# Altium schematic sheet LVDS_ADC.SchDoc: ADC &
size 420 x 297 mm; CheckedBy: MK; Author: G.K.; CompanyName: CREOTECH; DrawnBy: G.K.; Organization: CTI SA; Address1: Creotech Instruments SA; Address2: Okulickiego 7/9, 05-500 Poland; DocumentNumber: 2; Revision: -; SheetNumber: 2; SheetTotal: 5; ModifiedBy: -; CreateDate: XX/XX/XXXX; CheckedDate: -; Title2: reference; DivGrp: CTI; Designer: G.K.; ModifiedDate: -; ProjectName: FMC DAC 100M 14B 16CHA ADC 2M 14B 4CHA
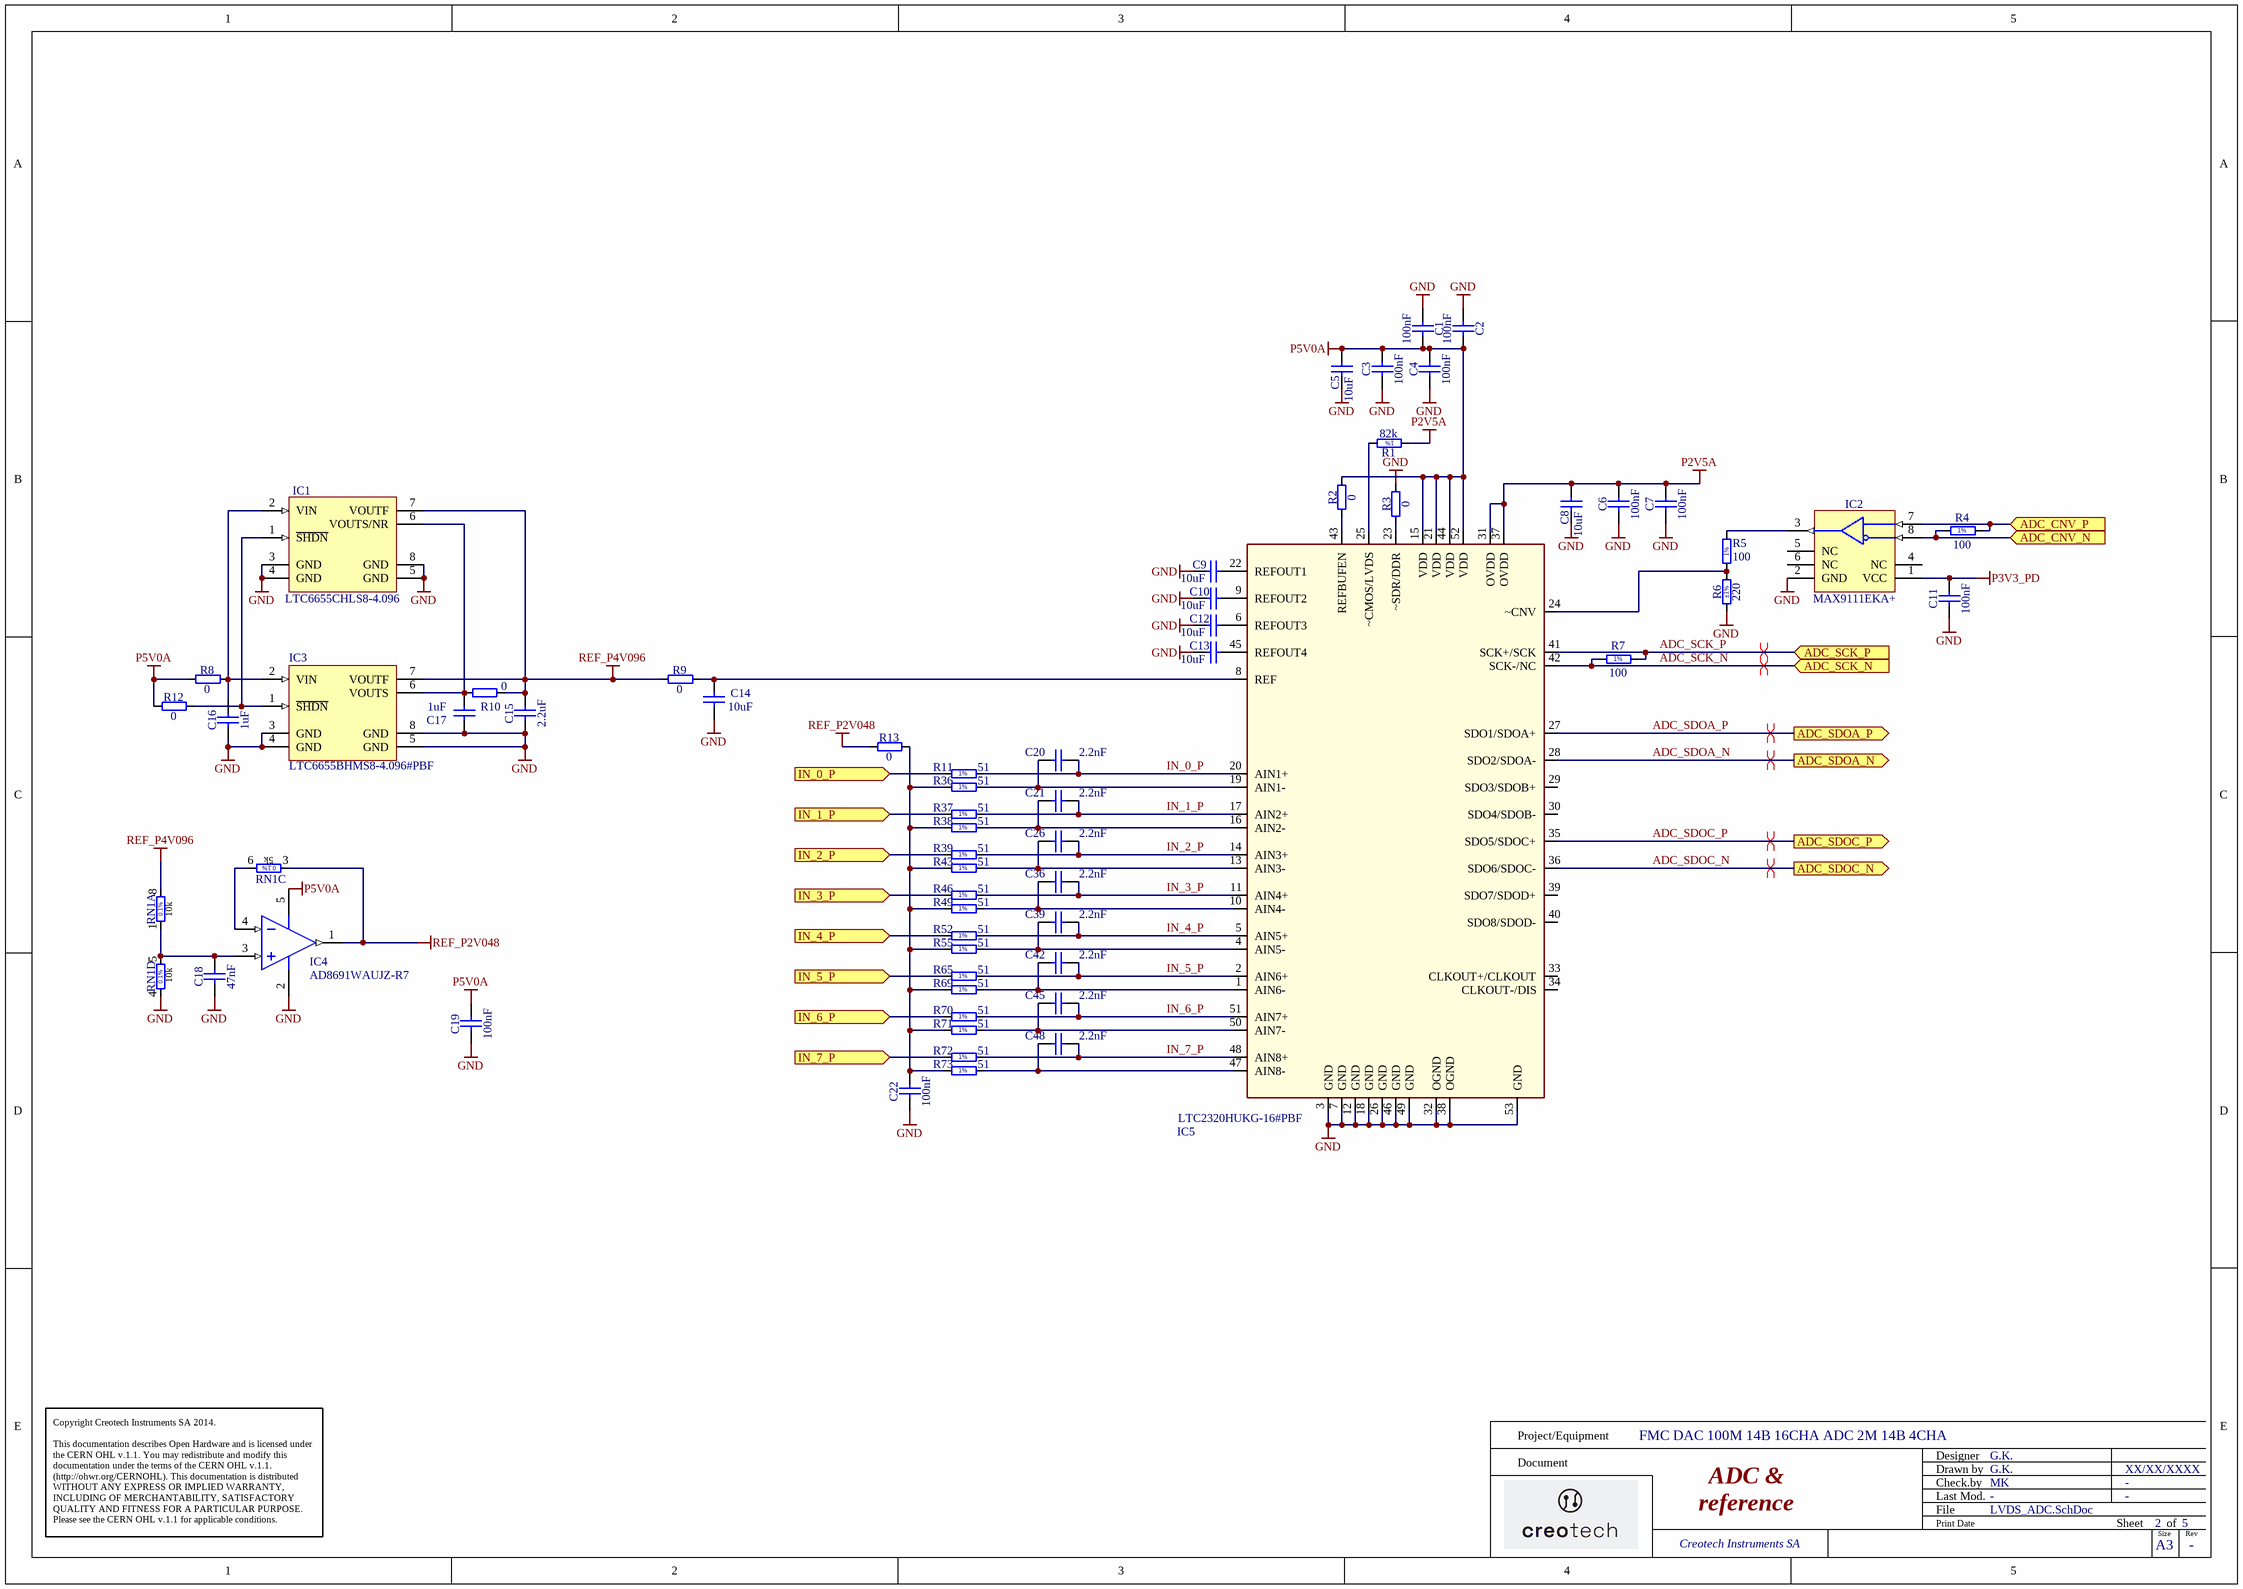
[diagram p0: LVDS_ADC.SchDoc]

## Parts
C1  100nF  [CAPC1608X87N]
C2  100nF  [CAPC1608X87N]
C3  100nF  [CAPC1608X87N]
C4  100nF  [CAPC1608X87N]
C5  10uF  [CAPC2012X95N]
C6  100nF  [CAPC1608X87N]
C7  100nF  [CAPC1608X87N]
C8  10uF  [CAPC2012X95N]
C9  10uF  [CAPC2012X95N]
C10  10uF  [CAPC2012X95N]
C11  100nF  [CAPC1608X87N]
C12  10uF  [CAPC2012X95N]
C13  10uF  [CAPC2012X95N]
C14  10uF  [CAPC2012X95N]
C15  2.2uF  [CAPC1608X87N]
C16  1uF  [CAPC1608X87N]
C17  1uF  [CAPC1608X87N]
C18  47nF  [CAPC2012X135N]
C19  100nF  [CAPC1005X55N]
C20  2.2nF  [CAPC2013X100N]
C21  2.2nF  [CAPC2013X100N]
C22  100nF  [CAPC1005X55N]
C26  2.2nF  [CAPC2013X100N]
C36  2.2nF  [CAPC2013X100N]
C39  2.2nF  [CAPC2013X100N]
C42  2.2nF  [CAPC2013X100N]
C45  2.2nF  [CAPC2013X100N]
C48  2.2nF  [CAPC2013X100N]
IC1  LTC6655CHLS8-4.096  [LCCS127P500X500X145-8N]
IC2  MAX9111EKA+  [SOT65P280X145-8N]
IC3  LTC6655BHMS8-4.096#PBF  [SOP65P490X110-8N]
IC4  AD8691WAUJZ-R7  [ADI-UJ-5_L]
IC5  LTC2320HUKG-16#PBF  [QFN50P700X800X80_HS-53M]
R1  82k  [RESC1608X55N]
R2  0  [RESC1005X40N]
R3  0  [RESC1005X40N]
R4  100  [RESC1005X40N]
R5  100  [RESC1005X40N]
R6  220  Tolerance: ±1%  [RESC1005X40N]
R7  100  [RESC1005X40N]
R8  0  [RESC1005X40N]
R9  0  [RESC1005X40N]
R10  0  [RESC1005X40N]
R11  51  [RESC1005X40N]
R12  0  [RESC1005X40N]
R13  0  [RESC1005X40N]
R36  51  [RESC1005X40N]
R37  51  [RESC1005X40N]
R38  51  [RESC1005X40N]
R39  51  [RESC1005X40N]
R43  51  [RESC1005X40N]
R46  51  [RESC1005X40N]
R49  51  [RESC1005X40N]
R52  51  [RESC1005X40N]
R55  51  [RESC1005X40N]
R65  51  [RESC1005X40N]
R69  51  [RESC1005X40N]
R70  51  [RESC1005X40N]
R71  51  [RESC1005X40N]
R72  51  [RESC1005X40N]
R73  51  [RESC1005X40N]
RN1  10k 5K 5K 10K  [SOIC127P600X175-8N]  (value not drawn)  (parts A,C,D of 4)

## Ports
ADC_CNV_N (in), ADC_CNV_P (in), ADC_SCK_N (in), ADC_SCK_P (in), ADC_SDOA_N (out), ADC_SDOA_P (out), ADC_SDOC_N (out), ADC_SDOC_P (out), IN_0_P (in), IN_1_P (in), IN_2_P (in), IN_3_P (in), IN_4_P (in), IN_5_P (in), IN_6_P (in), IN_7_P (in)

## Nets
GND: C1.1 C2.1 C3.1 C4.1 C5.1 C6.1 C7.1 C8.1 C9.1 C10.1 C11.1 C12.1 C13.1 C14.1 C15.1 C16.1 C17.1 C18.1 C19.1 C22.1 IC1.3(GND) IC1.4(GND) IC1.5(GND) IC1.8(GND) IC2.2(GND) IC3.3(GND) IC3.4(GND) IC3.5(GND) IC3.8(GND) IC4.2(-V) IC5.3(GND) IC5.7(GND) IC5.12(GND) IC5.18(GND) IC5.26(GND) IC5.32(OGND) IC5.38(OGND) IC5.46(GND) IC5.49(GND) IC5.53(GND) R3.2 R6.1 RN1.4
P2V5A: C6.2 C7.2 C8.2 IC5.31(OVDD) IC5.37(OVDD) R1.1
P3V3_PD: C11.2 IC2.1(VCC)
P5V0A: C1.2 C2.2 C3.2 C4.2 C5.2 C19.2 IC4.5(+V) IC5.15(VDD) IC5.21(VDD) IC5.44(VDD) IC5.52(VDD) R2.2 R8.1 R12.1
REF_P2V048: IC4.1(OUT) R13.1 RN1.3
REF_P4V096: C15.2 IC1.7(VOUTF) IC3.7(VOUTF) R9.1 R10.2 RN1.8
ADC_CNV_N: IC2.8(IN-) R4.1 ; port ADC_CNV_N
ADC_CNV_P: IC2.7(IN+) R4.2 ; port ADC_CNV_P
ADC_SCK_N: IC5.42(SCK-/NC) R7.1 ; port ADC_SCK_N
ADC_SCK_P: IC5.41(SCK+/SCK) R7.2 ; port ADC_SCK_P
ADC_SDOA_N: IC5.28(SDO2/SDOA-) ; port ADC_SDOA_N
ADC_SDOA_P: IC5.27(SDO1/SDOA+) ; port ADC_SDOA_P
ADC_SDOC_N: IC5.36(SDO6/SDOC-) ; port ADC_SDOC_N
ADC_SDOC_P: IC5.35(SDO5/SDOC+) ; port ADC_SDOC_P
IN_0_P: C20.1 IC5.20(AIN1+) R11.2
IN_0_P: R11.1 ; port IN_0_P  [a separate net that carries the same name]
IN_1_P: C21.1 IC5.17(AIN2+) R37.2
IN_1_P: R37.1 ; port IN_1_P  [a separate net that carries the same name]
IN_2_P: C26.1 IC5.14(AIN3+) R39.2
IN_2_P: R39.1 ; port IN_2_P  [a separate net that carries the same name]
IN_3_P: C36.1 IC5.11(AIN4+) R46.2
IN_3_P: R46.1 ; port IN_3_P  [a separate net that carries the same name]
IN_4_P: C39.1 IC5.5(AIN5+) R52.2
IN_4_P: R52.1 ; port IN_4_P  [a separate net that carries the same name]
IN_5_P: C42.1 IC5.2(AIN6+) R65.2
IN_5_P: R65.1 ; port IN_5_P  [a separate net that carries the same name]
IN_6_P: C45.1 IC5.51(AIN7+) R70.2
IN_6_P: R70.1 ; port IN_6_P  [a separate net that carries the same name]
IN_7_P: C48.1 IC5.48(AIN8+) R72.2
IN_7_P: R72.1 ; port IN_7_P  [a separate net that carries the same name]
NetC9_2: C9.2 IC5.22(REFOUT1)
NetC10_2: C10.2 IC5.9(REFOUT2)
NetC12_2: C12.2 IC5.6(REFOUT3)
NetC13_2: C13.2 IC5.45(REFOUT4)
NetC14_2: C14.2 IC5.8(REF) R9.2
NetC16_2: C16.2 IC1.2(VIN) IC3.2(VIN) R8.2
NetC17_2: C17.2 IC1.6(VOUTS/NR) IC3.6(VOUTS) R10.1
NetC18_2: C18.2 IC4.3(+IN) RN1.1 RN1.5
NetC20_2: C20.2 IC5.19(AIN1-) R36.2
NetC21_2: C21.2 IC5.16(AIN2-) R38.2
NetC22_2: C22.2 R13.2 R36.1 R38.1 R43.1 R49.1 R55.1 R69.1 R71.1 R73.1
NetC26_2: C26.2 IC5.13(AIN3-) R43.2
NetC36_2: C36.2 IC5.10(AIN4-) R49.2
NetC39_2: C39.2 IC5.4(AIN5-) R55.2
NetC42_2: C42.2 IC5.1(AIN6-) R69.2
NetC45_2: C45.2 IC5.50(AIN7-) R71.2
NetC48_2: C48.2 IC5.47(AIN8-) R73.2
NetIC1_1: IC1.1(~{SHDN}) IC3.1(~{SHDN}) R12.2
NetIC2_3: IC2.3(OUT) R5.2
NetIC4_4: IC4.4(-IN) RN1.6
NetIC5_23: IC5.23(~SDR/DDR) R3.1
NetIC5_24: IC5.24(~CNV) R5.1 R6.2
NetIC5_25: IC5.25(~CMOS/LVDS) R1.2
NetIC5_43: IC5.43(REFBUFEN) R2.1

Not connected (* = marked no-connect by the designer): IC2 4(NC) 5(NC) 6(NC); IC5 29(SDO3/SDOB+) 30(SDO4/SDOB-) 33(CLKOUT+/CLKOUT) 34(CLKOUT-/DIS) 39(SDO7/SDOD+) 40(SDO8/SDOD-)

## Layout directives
differential pair: ADC_SCK_N, ADC_SCK_P, ADC_SDOA_N, ADC_SDOA_P, ADC_SDOC_N, ADC_SDOC_P

## Notes on the sheet
- Project/Equipment
- Document
- Designer
- Drawn by
- Check.by
- Copyright Creotech Instruments SA 2014.
  This documentation describes Open Hardware and is licensed under the CERN OHL v.1.1. You may redistribute and modify this documentation under the terms of the CERN OHL v.1.1. (http://ohwr.org/CERNOHL). This documentation is distributed WITHOUT ANY EXPRESS OR IMPLIED WARRANTY, INCLUDING OF MERCHANTABILITY, SATISFACTORY QUALITY AND FITNESS FOR A PARTICULAR PURPOSE. Please see the CERN OHL v.1.1 for applicable conditions.
- File
- Last Mod.
- Print Date
- Sheet
- Size
- A3
- of
- Rev
- (in symbol R0402_51R_1%_0.0625W_100PPM) 1%
- (in symbol R0402_100R_1%_0.1W_100PPM) 1%
- (in symbol R0603_82K_1%_0.1W_100PPM) 1%
- (in symbol RN_10K_5K_VISHAY_AORN2-1AT3, part A) 10k
- (in symbol RN_10K_5K_VISHAY_AORN2-1AT3, part C) 5k
- (in symbol RN_10K_5K_VISHAY_AORN2-1AT3, part D) 10k

## Library data of the parts
C1-C4 C6 C7 C11 = CC0603_100NF_50V_10%_X7R: Non-polarised capacitor; Part Description: SMD Multilayer Chip Ceramic Capacitor; Manufacturer: GENERIC; Manufacturer1 Part Number: 223858615649; Voltage: 50V; TC: X7R; Tolerance: ±10%; Part Number: CC0603_100NF_50V_10%_X7R; Component Kind: Standard; Component Type: Standard; Pin Count: 2; Value: 100nF; Status: Preferred; Manufacturer Part Number: CC0603_100NF_50V_10%_X7R; Case: 0603; Mounted: Yes; Socket: No; SMD: Yes; Sense: No; Manufacturer1 Example: PHYCOMP; Manufacturer1 ComponentHeight: 0.87mm; HelpURL: \\cern.ch\dfs\Applications\Altium\Datasheets\CC0603_X7R_PHYCOMP.pdf; Author: CERN DEM JLC; CreateDate: 03.12.2007; LatestRevisionDate: 03.12.2007
C5 C8-C10 C12-C14 = CC0805_10UF_25V_10%_X5R: Non-polarised capacitor; Part Description: SMD Multilayer Chip Ceramic Capacitor; Manufacturer: GENERIC; Manufacturer1 Part Number: GRM219R61E106KA12D; Voltage: 25V; TC: X5R; Tolerance: ±10%; Part Number: CC0805_10UF_25V_10%_X5R; Component Kind: Standard; Component Type: Standard; Pin Count: 2; Value: 10uF; Status: Preferred; Manufacturer Part Number: CC0805_10UF_25V_10%_X5R; Case: 0805; Mounted: Yes; Socket: No; SMD: Yes; Sense: No; Manufacturer1 Example: MURATA; Manufacturer1 ComponentHeight: 0.95mm; HelpURL: \\cern.ch\dfs\Applications\Altium\Datasheets\CC0805_X5R_MURATA_GRM.pdf; Author: CERN DEM JLC; CreateDate: 25.10.2012; LatestRevisionDate: 06.09.2016
C15 = CC0603_2.2UF_16V_10%_X5R: Non-polarised capacitor; Part Description: SMD Multilayer Chip Ceramic Capacitor; Manufacturer: GENERIC; Manufacturer1 Part Number: CC0603KRX5R7BB225; Voltage: 16V; TC: X5R; Tolerance: ±10%; Part Number: CC0603_2.2UF_16V_10%_X5R; Component Kind: Standard; Component Type: Standard; Pin Count: 2; Value: 2.2uF; Status: Preferred; Manufacturer Part Number: CC0603_2.2UF_16V_10%_X5R; Case: 0603; Mounted: Yes; Socket: No; SMD: Yes; Sense: No; Manufacturer1 Example: YAGEO; Manufacturer1 ComponentHeight: 0.9mm; HelpURL: \\cern.ch\dfs\Applications\Altium\Datasheets\CC0805_X5R_PHYCOMP_HC.pdf; Author: CERN DEM JLC; CreateDate: 28.04.2011; LatestRevisionDate: 28.04.2011
C16 C17 = CC0603_1UF_25V_10%_X7R: Non-polarised capacitor; Part Description: SMD Multilayer Chip Ceramic Capacitor; Manufacturer: GENERIC; Manufacturer1 Part Number: GRM188R71E105KA12D; Voltage: 25V; TC: X7R; Tolerance: ±10%; Part Number: CC0603_1UF_25V_10%_X7R; Component Kind: Standard; Component Type: Standard; Pin Count: 2; Value: 1uF; Status: None; Manufacturer Part Number: CC0603_1UF_25V_10%_X7R; Case: 0603; Mounted: Yes; Socket: No; SMD: Yes; Sense: No; Manufacturer1 Example: MURATA; Manufacturer1 ComponentHeight: 0.9mm; HelpURL: \\cern.ch\dfs\Applications\Altium\Datasheets\CC0603_X7R_MURATA.pdf; Author: CERN DEM JLC; CreateDate: 18.01.2011; LatestRevisionDate: 18.01.2011
C18 = CC0805_47NF_25V_5%_C0G: Non-polarised capacitor; Part Description: SMD Multilayer Chip Ceramic Capacitor; Manufacturer: GENERIC; Manufacturer1 Part Number: C0805C473J3GACTU; Voltage: 25V; TC: C0G/NP0; Tolerance: ±5%; Part Number: CC0805_47NF_25V_5%_C0G; Component Kind: Standard; Component Type: Standard; Pin Count: 2; Value: 47nF; Status: None; Manufacturer Part Number: CC0805_47NF_25V_5%_C0G; Case: 0805; Mounted: Yes; Socket: No; SMD: Yes; Sense: No; Manufacturer1 Example: KEMET; Manufacturer1 ComponentHeight: 1.4mm; HelpURL: \\cern.ch\dfs\Applications\Altium\Datasheets\CC0805_C0G_KEMET_(Commercial Grade).pdf; Author: CERN DEM JLC; CreateDate: 18.01.2011; LatestRevisionDate: 18.01.2011
C19 C22 = CC0402_100NF_16V_10%_X5R: Non-polarised capacitor; Part Description: SMD Multilayer Chip Ceramic Capacitor; Manufacturer: GENERIC; Manufacturer1 Part Number: GRM155R61C104KA88D; Voltage: 16V; TC: X5R; Tolerance: ±10%; Part Number: CC0402_100NF_16V_10%_X5R; Component Kind: Standard; Component Type: Standard; Pin Count: 2; Value: 100nF; Status: None; Manufacturer Part Number: CC0402_100NF_16V_10%_X5R; Case: 0402; Mounted: Yes; Socket: No; SMD: Yes; Sense: No; Manufacturer1 Example: MURATA; Manufacturer1 ComponentHeight: 0.55mm; HelpURL: \\cern.ch\dfs\Applications\Altium\Datasheets\CC0402_X5R_MURATA_GRM.pdf; Author: CERN DEM JLC; CreateDate: 10.12.2013; LatestRevisionDate: 10.12.2013
C20 C21 C26 C36 C39 C42 C45 C48 = CC0805_2.2NF_25V_1%_C0G: Non-polarised capacitor; Part Description: SMD Multilayer Chip Ceramic Capacitor; Manufacturer: GENERIC; Manufacturer1 Part Number: C0805C222F3GACTU; Voltage: 25V; TC: C0G/NP0; Tolerance: ±1%; Part Number: CC0805_2.2NF_25V_1%_C0G; Component Kind: Standard; Component Type: Standard; Pin Count: 2; Value: 2.2nF; Status: None; Manufacturer Part Number: CC0805_2.2NF_25V_1%_C0G; Case: 0805; Mounted: Yes; Socket: No; SMD: Yes; Sense: No; Manufacturer1 Example: KEMET; Manufacturer1 ComponentHeight: 0.88mm; HelpURL: \\cern.ch\dfs\Applications\Altium\Datasheets\CC0805_C0G_KEMET_(Commercial Grade).pdf; Author: CERN DEM JLC; CreateDate: 11.03.2015; LatestRevisionDate: 11.03.2015
IC1 = REF_LTC6655CHLS8-4.096: 4.096, 1uA Precision Voltage Reference; Part Number: LTC6655CHLS8-4.096#PBF; Part Description: 4.096V, 0.05%, 10ppm/°C, 1uA Precision Voltage Reference; Manufacturer: LINEAR TECHNOLOGY; PressFit: No; Bonding: No; Component Kind: Standard; Component Type: Standard; Device: LTC6655CHLS8-4.096; Footprint: SOT95P280X100-6N; PackageDescription: LCC, 8-Pins, Body 5,00x5,00mmx1,45mm, Pitch 1,27mm, IPC Medium Density; Manufacturer Part Number: LTC6655CHLS8-4.096#PBF; Pin Count: 8; Case: 8-CLCC; Mounted: Yes; Socket: No; SMD: Yes; Sense: No; ComponentHeight: 1mm; HelpURL: \\cern.ch\dfs\Applications\Altium\Datasheets\LT6656ACS6-3.3#TRMPBF.pdf; Author: GK; CreateDate: 2011-10-10; LatestRevisionDate: 2011-10-10
IC2 = MAX9111EKA+: Single LVDS Line Receiver with Ultra-Low Pulse Skew; Manufacturer: MAXIM; PressFit: No; Bonding: No; Part Number: MAX9111EKA+; Component Kind: Standard; Component Type: Standard; Device: MAX9111EKA+; PackageDescription: SOT, 0.65mm pitch; 8 pin, 1.625mm W X 2.90mm L X 1.45mm H body, IPC Medium Density; Part Description: Single LVDS Line Receiver with Ultra-Low Pulse Skew; Manufacturer Part Number: MAX9111EKA+; Pin Count: 8; Case: SOT23-8; Mounted: Yes; Socket: No; SMD: Yes; Sense: No; ComponentHeight: 1.45mm; Author: CERN DEM JLC; HelpURL: \\cern.ch\dfs\Applications\Altium\Datasheets\MAX9111EKA+.pdf; CreateDate: 26.09.2013; LatestRevisionDate: 26.09.2013
IC3 = REF_LTC6655: 0.25ppm Noise, Low Drift Precision Buffered Voltage Reference; Part Description: 4.096V, 0.25ppm Noise, Low Drift Precision Buffered Voltage Reference; Manufacturer: LINEAR TECHNOLOGY; PressFit: No; Bonding: No; Part Number: LTC6655BHMS8-4.096#PBF; Component Kind: Standard; Component Type: Standard; Device: LTC6655BHMS8-4.096#PBF; PackageDescription: SOP, 8-Leads, Body 3.1x3.1mm (max), Pitch 0.65mm, IPC Medium Density; Manufacturer Part Number: LTC6655BHMS8-4.096#PBF; Pin Count: 8; Case: SSOP8; Mounted: Yes; Socket: No; SMD: Yes; Sense: No; ComponentHeight: 1.1mm; HelpURL: \\cern.ch\dfs\Applications\Altium\Datasheets\LTC6655BHMS8-5#PBF.pdf; Author: GK; CreateDate: 07.06.2012; LatestRevisionDate: 07.06.2012
IC4 = CMP-0384-02080-1: Single Channel Wide Bandwidth Operational Amplifier, 10 MHz BW, 5 V/us SR, Automotive, 5-pin SOT23 (UJ-5), Reel; Manufacturer: Analog Devices; Generic Part Number: AD8691; Small Signal Bandwidth: 10MHz; Input Offset Voltage: 400uV; V Span Max: 6V; Automotive Qualified: Yes; Slew Rate: 5V/us; Iq/Amp: 1.05mA; Amplifiers Per Package: 1; Input Bias Current: 200fA; V Span Min: 2.7V; ComponentLink2URL: http://www.analog.com/static/imported-files/data_sheets/AD8691_8692_8694.pdf; ComponentLink3Description: Package Specification; ComponentLink1Description: Manufacturer URL; ComponentLink1URL: http://www.analog.com/en/index.html; PackageReference: UJ-5; DatasheetVersion: Rev. E; PartNumber: AD8691WAUJZ-R7; PackageVersion: 100708-A; PackageDescription: 5-Pin Thin Small Outline Transistor Package, Body 2.9 x 1.6 mm, Pitch 0.95 mm; Code_JEDEC: MO-193-AB; Mounting Technology: Surface Mount; ComponentLink3URL: http:/www.analog.com/static/imported-files/packages/PKG_PDF/TSOT(UJ)/UJ_5.pdf; ComponentLink2Description: Datasheet
IC5 = ADC_LTC2320HUKG-16: Octal, 16-Bit, 1.5Msps/Ch  Simultaneous Sampling ADC; Manufacturer: LINEAR TECHNOLOGY; PressFit: No; Bonding: No; Part Number: LTC2320HUKG-16#PBF; Component Kind: Standard; Component Type: Standard; Device: LTC2320HUKG-16#PBF; PackageDescription: QFN, 52-Leads, Body 7.00x8.00mm, Pitch 0.50mm, Thermal Pad 5.41x6.40mm, IPC Low Density; Part Description: Octal, 16-Bit, 1.5Msps/Ch  Simultaneous Sampling ADC; Manufacturer Part Number: LTC2320HUKG-16#PBF; Pin Count: 48; Case: QFP48; Mounted: Yes; Socket: No; SMD: Yes; Sense: No; ComponentHeight: 0.8; Author: GK; HelpURL: \\cern.ch\dfs\Applications\Altium\Datasheets\LTC2335CLX-18#PBF.pdf; CreateDate: 10.01.2017; LatestRevisionDate: 10.01.2017
R1 = R0603_82K_1%_0.1W_100PPM: Resistor - 1%; Part Description: General Purpose Thick Film Chip Resistor; Manufacturer: GENERIC; Manufacturer1 Part Number: NRC06F8202TRF; Power: 0.1W; TC: ±100ppm/°C; Part Number: R0603_82K_1%_0.1W_100PPM; Component Kind: Standard; Component Type: Standard; Pin Count: 2; Value: 82k; Status: Preferred; Tolerance: ±1%; Manufacturer Part Number: R0603_82K_1%_0.1W_100PPM; Case: 0603; Mounted: Yes; Sense: No; Socket: No; SMD: Yes; Manufacturer1 Example: NIC COMPONENT; Manufacturer1 ComponentHeight: 0.55mm; HelpURL: \\cern.ch\dfs\Applications\Altium\Datasheets\R0603_NIC_NRC.pdf; Author: CERN DEM JLC; CreateDate: 03.12.2007; LatestRevisionDate: 13.03.2008
R2 R3 R8-R10 R12 R13 = R0402_0R_JUMPER: Resistor; Part Description: 1A (0.05R Max DC Resistance) Zero Ohm Jumper; Manufacturer: GENERIC; Manufacturer1 Part Number: 232270591001L; Part Number: R0402_0R_JUMPER; Component Kind: Standard; Component Type: Standard; Pin Count: 2; Value: 0; Status: Not recommended; Manufacturer Part Number: R0402_0R_JUMPER; Case: 0402; Mounted: Yes; Sense: No; Socket: No; SMD: Yes; Manufacturer1 Example: YAGEO PHYCOMP; Manufacturer1 ComponentHeight: 0.4mm; HelpURL: \\cern.ch\dfs\Applications\Altium\Datasheets\R0402_Phycomp_RC0402.pdf; Author: CERN DEM JLC; CreateDate: 03.12.2007; LatestRevisionDate: 17.10.2012
R4 R5 R7 = R0402_100R_1%_0.1W_100PPM: Resistor - 1%; Part Description: General Purpose Thick Film Chip Resistor; Manufacturer: GENERIC; Manufacturer Part Number: R0402_100R_1%_0.1W_100PPM_50V; Manufacturer1 Part Number: ERJ2RKF1000X; Power: 0.1W; TC: ±100ppm/°C; Voltage: 50V; Part Number: R0402_100R_1%_0.1W_100PPM; Component Kind: Standard; Component Type: Standard; Pin Count: 2; Value: 100; Status: Not recommended; Tolerance: ±1%; Case: 0402; Mounted: Yes; Sense: No; Socket: No; SMD: Yes; Manufacturer1 Example: PANASONIC; Manufacturer1 ComponentHeight: 0.4mm; HelpURL: \\cern.ch\dfs\Applications\Altium\Datasheets\R0402_PANASONIC_ERJ2RK.pdf; Author: CERN DEM JLC; CreateDate: 12.12.2013; LatestRevisionDate: 03.03.2015
R6 = R0402_220R_1%_0.0625W_100PPM: Resistor - 1%; Part Description: General Purpose Thick Film Chip Resistor; Manufacturer: GENERIC; Manufacturer1 Part Number: 232270672201L; TC: ±100ppm/°C; PressFit: No; Part Number: R0402_220R_1%_0.0625W_100PPM; Component Kind: Standard; Component Type: Standard; Pin Count: 2; Value: 220; Status: Not Recommended; Power: 0.0625W; Manufacturer Part Number: R0402_220R_1%_0.0625W_100PPM; Case: 0402; Mounted: Yes; Sense: No; Socket: No; SMD: Yes; Manufacturer1 Example: YAGEO PHYCOMP; Manufacturer1 ComponentHeight: 0.4mm; HelpURL: \\cern.ch\dfs\Applications\Altium\Datasheets\R0402_Phycomp_RC0402.pdf; Author: CERN DEM JLC; CreateDate: 03.12.2007; LatestRevisionDate: 17.10.2012
R11 R36-R39 R43 R46 R49 R52 R55 R65 R69-R73 = R0402_51R_1%_0.0625W_100PPM: Resistor - 1%; Part Description: General Purpose Thick Film Chip Resistor; Manufacturer: GENERIC; Manufacturer1 Part Number: 232270675109L; TC: ±100ppm/°C; PressFit: No; Part Number: R0402_51R_1%_0.0625W_100PPM; Component Kind: Standard; Component Type: Standard; Pin Count: 2; Value: 51; Status: Not Recommended; Power: 0.0625W; Tolerance: ±1%; Manufacturer Part Number: R0402_51R_1%_0.0625W_100PPM; Case: 0402; Mounted: Yes; Sense: No; Socket: No; SMD: Yes; Manufacturer1 Example: YAGEO PHYCOMP; Manufacturer1 ComponentHeight: 0.4mm; HelpURL: \\cern.ch\dfs\Applications\Altium\Datasheets\R0402_Phycomp_RC0402.pdf; Author: CERN DEM JLC; CreateDate: 03.12.2007; LatestRevisionDate: 17.10.2012
RN1 = RN_10K_5K_VISHAY_AORN2-1AT3: DIL8 Resistor Network 4 Resistors 10k-5k-5k-10k 0.1%; Part Description: Dual-In-Line Thin Film Precision Automotive Resistors Network, (4 Isolated) - AORN Series; Manufacturer: VISHAY DALE; Power: 4x0.1W; TC: ±25ppm/°C; PressFit: No; Part Number: RN_10K_5K_VISHAY_AORN2-1AT3; Component Kind: Standard; Component Type: Standard; Pin Count: 8; Value: 10k 5K 5K 10K; Sense: No; Tolerance: 0.1%; Manufacturer Part Number: AORN2-1AT3; Case: SOIC8; Mounted: Yes; Socket: No; SMD: Yes; ComponentHeight: 1.73mm; HelpURL: \\cern.ch\dfs\Applications\Altium\Datasheets\RN_VISHAY_AORN.pdf; Author: CERN DEM JLC; CreateDate: 20.02.2017; LatestRevisionDate: 20.02.2017